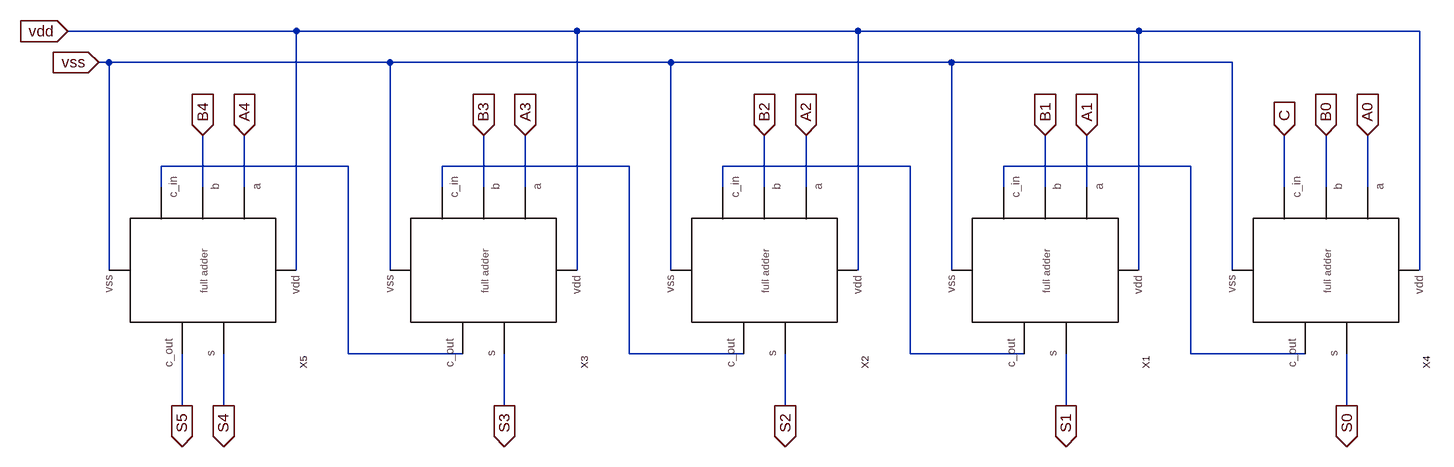
[diagram p0: schematic five_bit_adder.asc]
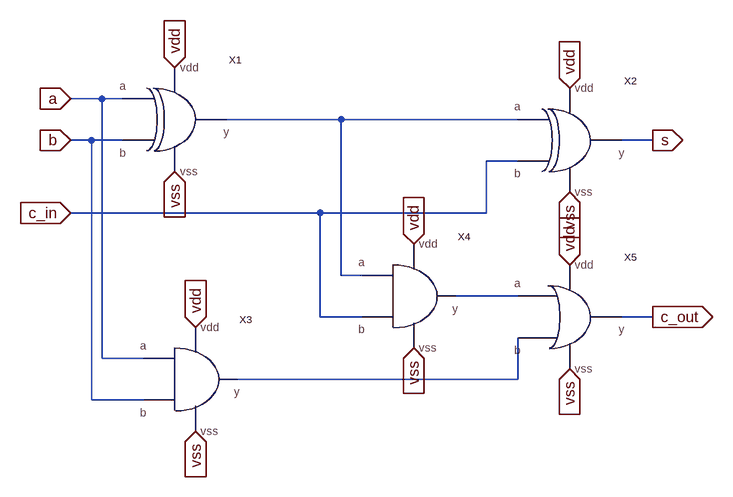
[diagram p1: sub-circuit full_adder.asc]
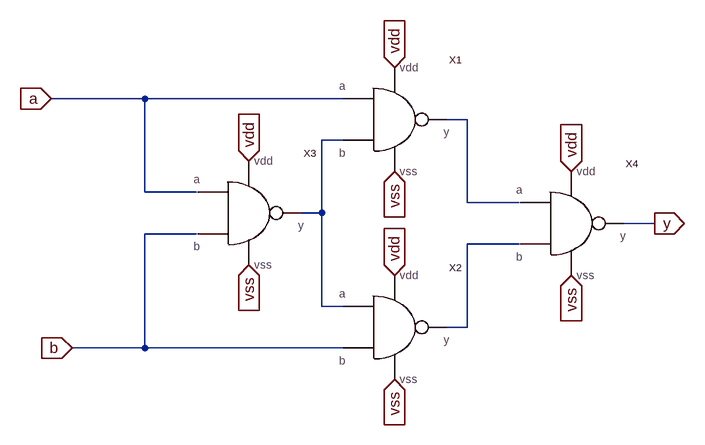
[diagram p2: sub-circuit xor.asc]
five_bit_adder.asc, the LTspice schematic file:
Version 4
SHEET 1 1208 736
WIRE -928 -1152 -1280 -1152
WIRE -496 -1152 -928 -1152
WIRE -64 -1152 -496 -1152
WIRE 368 -1152 -64 -1152
WIRE 800 -1152 368 -1152
WIRE -1216 -1104 -1232 -1104
WIRE -784 -1104 -1216 -1104
WIRE -352 -1104 -784 -1104
WIRE 80 -1104 -352 -1104
WIRE 512 -1104 80 -1104
WIRE -848 -944 -1136 -944
WIRE -416 -944 -704 -944
WIRE 16 -944 -272 -944
WIRE 448 -944 160 -944
WIRE -1136 -912 -1136 -944
WIRE -1072 -912 -1072 -992
WIRE -1008 -912 -1008 -992
WIRE -704 -912 -704 -944
WIRE -640 -912 -640 -992
WIRE -576 -912 -576 -992
WIRE -272 -912 -272 -944
WIRE -208 -912 -208 -992
WIRE -144 -912 -144 -992
WIRE 160 -912 160 -944
WIRE 224 -912 224 -992
WIRE 288 -912 288 -992
WIRE 592 -912 592 -992
WIRE 656 -912 656 -992
WIRE 720 -912 720 -992
WIRE -1216 -784 -1216 -1104
WIRE -928 -784 -928 -1152
WIRE -784 -784 -784 -1104
WIRE -496 -784 -496 -1152
WIRE -352 -784 -352 -1104
WIRE -64 -784 -64 -1152
WIRE 80 -784 80 -1104
WIRE 368 -784 368 -1152
WIRE 512 -784 512 -1104
WIRE 800 -784 800 -1152
WIRE -848 -656 -848 -944
WIRE -672 -656 -848 -656
WIRE -416 -656 -416 -944
WIRE -240 -656 -416 -656
WIRE 16 -656 16 -944
WIRE 192 -656 16 -656
WIRE 448 -656 448 -944
WIRE 624 -656 448 -656
WIRE -1104 -576 -1104 -656
WIRE -1040 -576 -1040 -656
WIRE -608 -576 -608 -656
WIRE -176 -576 -176 -656
WIRE 256 -576 256 -656
WIRE 688 -576 688 -656
FLAG -1280 -1152 vdd
IOPIN -1280 -1152 In
FLAG -1232 -1104 vss
IOPIN -1232 -1104 In
FLAG 288 -992 A1
IOPIN 288 -992 In
FLAG 224 -992 B1
IOPIN 224 -992 In
FLAG 720 -992 A0
IOPIN 720 -992 In
FLAG 656 -992 B0
IOPIN 656 -992 In
FLAG -144 -992 A2
IOPIN -144 -992 In
FLAG -208 -992 B2
IOPIN -208 -992 In
FLAG -576 -992 A3
IOPIN -576 -992 In
FLAG -640 -992 B3
IOPIN -640 -992 In
FLAG -1008 -992 A4
IOPIN -1008 -992 In
FLAG -1072 -992 B4
IOPIN -1072 -992 In
FLAG 688 -576 S0
IOPIN 688 -576 Out
FLAG 256 -576 S1
IOPIN 256 -576 Out
FLAG -176 -576 S2
IOPIN -176 -576 Out
FLAG -608 -576 S3
IOPIN -608 -576 Out
FLAG -1040 -576 S4
IOPIN -1040 -576 Out
FLAG -1104 -576 S5
IOPIN -1104 -576 Out
FLAG 592 -992 C
IOPIN 592 -992 In
SYMBOL full_adder 128 -784 R90
SYMATTR InstName X1
SYMBOL full_adder -304 -784 R90
SYMATTR InstName X2
SYMBOL full_adder -736 -784 R90
SYMATTR InstName X3
SYMBOL full_adder 560 -784 R90
SYMATTR InstName X4
SYMBOL full_adder -1168 -784 R90
SYMATTR InstName X5

full_adder.asc, the sub-circuit schematic file:
Version 4
SHEET 1 1124 680
WIRE 128 -80 80 -80
WIRE 160 -80 128 -80
WIRE 496 -48 320 -48
WIRE 768 -48 496 -48
WIRE 112 -16 80 -16
WIRE 160 -16 112 -16
WIRE 976 -16 928 -16
WIRE 768 16 720 16
WIRE 464 96 80 96
WIRE 720 96 720 16
WIRE 720 96 464 96
WIRE 496 192 496 -48
WIRE 528 192 496 192
WIRE 768 224 672 224
WIRE 464 256 464 96
WIRE 528 256 464 256
WIRE 976 256 928 256
WIRE 128 320 128 -80
WIRE 192 320 128 320
WIRE 768 352 768 288
WIRE 768 352 336 352
WIRE 112 384 112 -16
WIRE 192 384 112 384
FLAG 80 -80 a
IOPIN 80 -80 In
FLAG 240 -128 vdd
IOPIN 240 -128 In
FLAG 976 -16 s
IOPIN 976 -16 Out
FLAG 240 32 vss
IOPIN 240 32 In
FLAG 80 -16 b
IOPIN 80 -16 In
FLAG 848 -96 vdd
IOPIN 848 -96 In
FLAG 848 64 vss
IOPIN 848 64 In
FLAG 80 96 c_in
IOPIN 80 96 In
FLAG 272 272 vdd
IOPIN 272 272 In
FLAG 272 432 vss
IOPIN 272 432 In
FLAG 608 144 vdd
IOPIN 608 144 In
FLAG 608 304 vss
IOPIN 608 304 In
FLAG 976 256 c_out
IOPIN 976 256 Out
FLAG 848 176 vdd
IOPIN 848 176 In
FLAG 848 336 vss
IOPIN 848 336 In
SYMBOL xor 240 -48 R0
SYMATTR InstName X1
SYMBOL xor 848 -16 R0
SYMATTR InstName X2
SYMBOL and 272 352 R0
SYMATTR InstName X3
SYMBOL and 608 224 R0
SYMATTR InstName X4
SYMBOL or 848 256 R0
SYMATTR InstName X5

xor.asc, the sub-circuit schematic file:
Version 4
SHEET 1 1608 784
WIRE 144 128 0 128
WIRE 448 128 144 128
WIRE 640 160 608 160
WIRE 448 192 416 192
WIRE 144 272 144 128
WIRE 224 272 144 272
WIRE 640 288 640 160
WIRE 720 288 640 288
WIRE 416 304 416 192
WIRE 416 304 384 304
WIRE 928 320 880 320
WIRE 224 336 144 336
WIRE 720 352 640 352
WIRE 416 448 416 304
WIRE 448 448 416 448
WIRE 640 480 640 352
WIRE 640 480 608 480
WIRE 144 512 144 336
WIRE 144 512 32 512
WIRE 448 512 144 512
FLAG 0 128 a
IOPIN 0 128 In
FLAG 928 320 y
IOPIN 928 320 Out
FLAG 32 512 b
IOPIN 32 512 In
FLAG 304 224 vdd
IOPIN 304 224 In
FLAG 304 384 vss
IOPIN 304 384 In
FLAG 528 80 vdd
IOPIN 528 80 In
FLAG 528 240 vss
IOPIN 528 240 In
FLAG 528 400 vdd
IOPIN 528 400 In
FLAG 528 560 vss
IOPIN 528 560 In
FLAG 800 240 vdd
IOPIN 800 240 In
FLAG 800 400 vss
IOPIN 800 400 In
SYMBOL nand 304 304 R0
SYMATTR InstName X3
SYMBOL nand 528 160 R0
SYMATTR InstName X1
SYMBOL nand 528 480 R0
SYMATTR InstName X2
SYMBOL nand 800 320 R0
SYMATTR InstName X4

The netlist it stands for:
* five_bit_adder.asc
XX1 vdd vss A1 B1 N004 S1 N003 full_adder
XX2 vdd vss A2 B2 N003 S2 N002 full_adder
XX3 vdd vss A3 B3 N002 S3 N001 full_adder
XX4 vdd vss A0 B0 C S0 N004 full_adder
XX5 vdd vss A4 B4 N001 S4 S5 full_adder

* block symbol definitions
.subckt full_adder vdd vss a b c_in s c_out
XX1 a b N001 vdd vss xor
XX2 N001 c_in s vdd vss xor
XX3 a b N003 vdd vss and  ; pins a b y vdd vss
XX4 N001 c_in N002 vdd vss and  ; pins a b y vdd vss
XX5 N002 N003 c_out vdd vss or  ; pins a b y vdd vss
.ends full_adder

.subckt xor a b y vdd vss
XX3 a b N002 vdd vss nand  ; pins a b y vdd vss
XX1 a N002 N001 vdd vss nand  ; pins a b y vdd vss
XX2 N002 b N003 vdd vss nand  ; pins a b y vdd vss
XX4 N001 N003 y vdd vss nand  ; pins a b y vdd vss
.ends xor

.backanno
.end